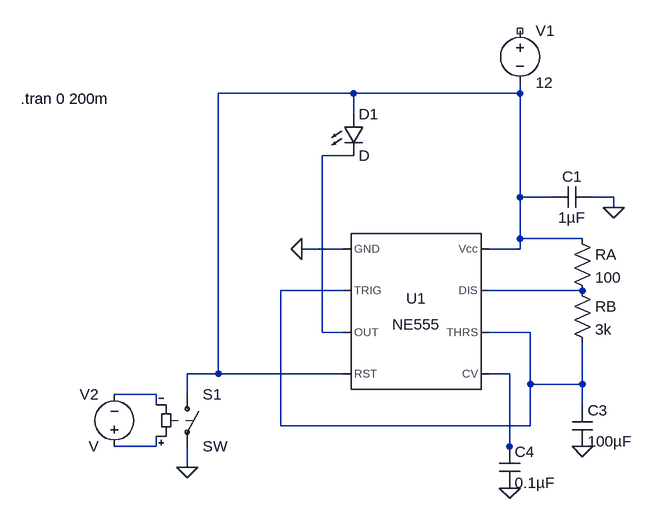
[diagram p0: schematic tsal-ltspice-sim.asc]
tsal-ltspice-sim.asc, the LTspice schematic file:
Version 4
SHEET 1 1040 1056
WIRE 608 -112 400 -112
WIRE 864 -112 864 -128
WIRE 864 -112 608 -112
WIRE 608 -80 608 -112
WIRE 608 -16 560 -16
WIRE 864 48 864 -112
WIRE 912 48 864 48
WIRE 1008 48 976 48
WIRE 1008 64 1008 48
WIRE 864 112 864 48
WIRE 960 112 864 112
WIRE 592 128 528 128
WIRE 864 128 864 112
WIRE 864 128 816 128
WIRE 592 192 496 192
WIRE 960 192 816 192
WIRE 560 256 560 -16
WIRE 592 256 560 256
WIRE 880 256 816 256
WIRE 400 320 400 -112
WIRE 400 320 352 320
WIRE 592 320 400 320
WIRE 848 320 816 320
WIRE 880 336 880 256
WIRE 960 336 960 272
WIRE 960 336 880 336
WIRE 304 352 240 352
WIRE 352 352 352 320
WIRE 304 368 304 352
WIRE 960 368 960 336
WIRE 496 400 496 192
WIRE 880 400 880 336
WIRE 880 400 496 400
WIRE 304 432 304 416
WIRE 304 432 240 432
WIRE 848 432 848 320
WIRE 848 448 848 432
WIRE 352 464 352 432
FLAG 1008 64 0
FLAG 960 432 0
FLAG 848 496 0
FLAG 352 464 0
FLAG 528 128 0
SYMBOL Misc/NE555 704 224 R0
SYMATTR InstName U1
SYMBOL voltage 864 -224 R0
SYMATTR InstName V1
SYMATTR Value 12
SYMBOL cap 976 32 R90
WINDOW 0 0 32 VBottom 2
WINDOW 3 32 32 VTop 2
SYMATTR InstName C1
SYMATTR Value 1µF
SYMBOL res 944 176 R0
SYMATTR InstName RB
SYMATTR Value 3k
SYMBOL Cap 944 368 R0
SYMATTR InstName C3
SYMATTR Value 100µF
SYMBOL Res 944 96 R0
SYMATTR InstName RA
SYMATTR Value 100
SYMBOL Cap 832 432 R0
SYMATTR InstName C4
SYMATTR Value 0.1µF
SYMBOL LED 592 -80 R0
SYMATTR InstName D1
SYMBOL sw 352 336 R0
SYMATTR InstName S1
SYMBOL Voltage 240 448 R180
WINDOW 0 24 96 Left 2
WINDOW 3 24 16 Left 2
SYMATTR InstName V2
TEXT 96 -104 Left 2 !.tran 0 200m

The netlist it stands for:
* tsal-ltspice-sim.asc
XU1 0 N003 N002 N001 N005 N003 N004 N001 NE555  ; pins GND TRIG OUT RST CV THRS DIS Vcc
V1 NC_01 N001 12
C1 0 N001 1µF
RB N004 N003 3k
C3 N003 0 100µF
RA N001 N004 100
C4 N005 0 0.1µF
D1 N001 N002 D
S1 N001 0 N007 N006 SW
V2 N007 N006 V
.model D D
.lib standard.dio
.tran 0 200m
.lib NE555.sub
.backanno
.end